# EAGLE design motion_sensor (EAGLE 7.7.0)

## Sheet 1 of 2
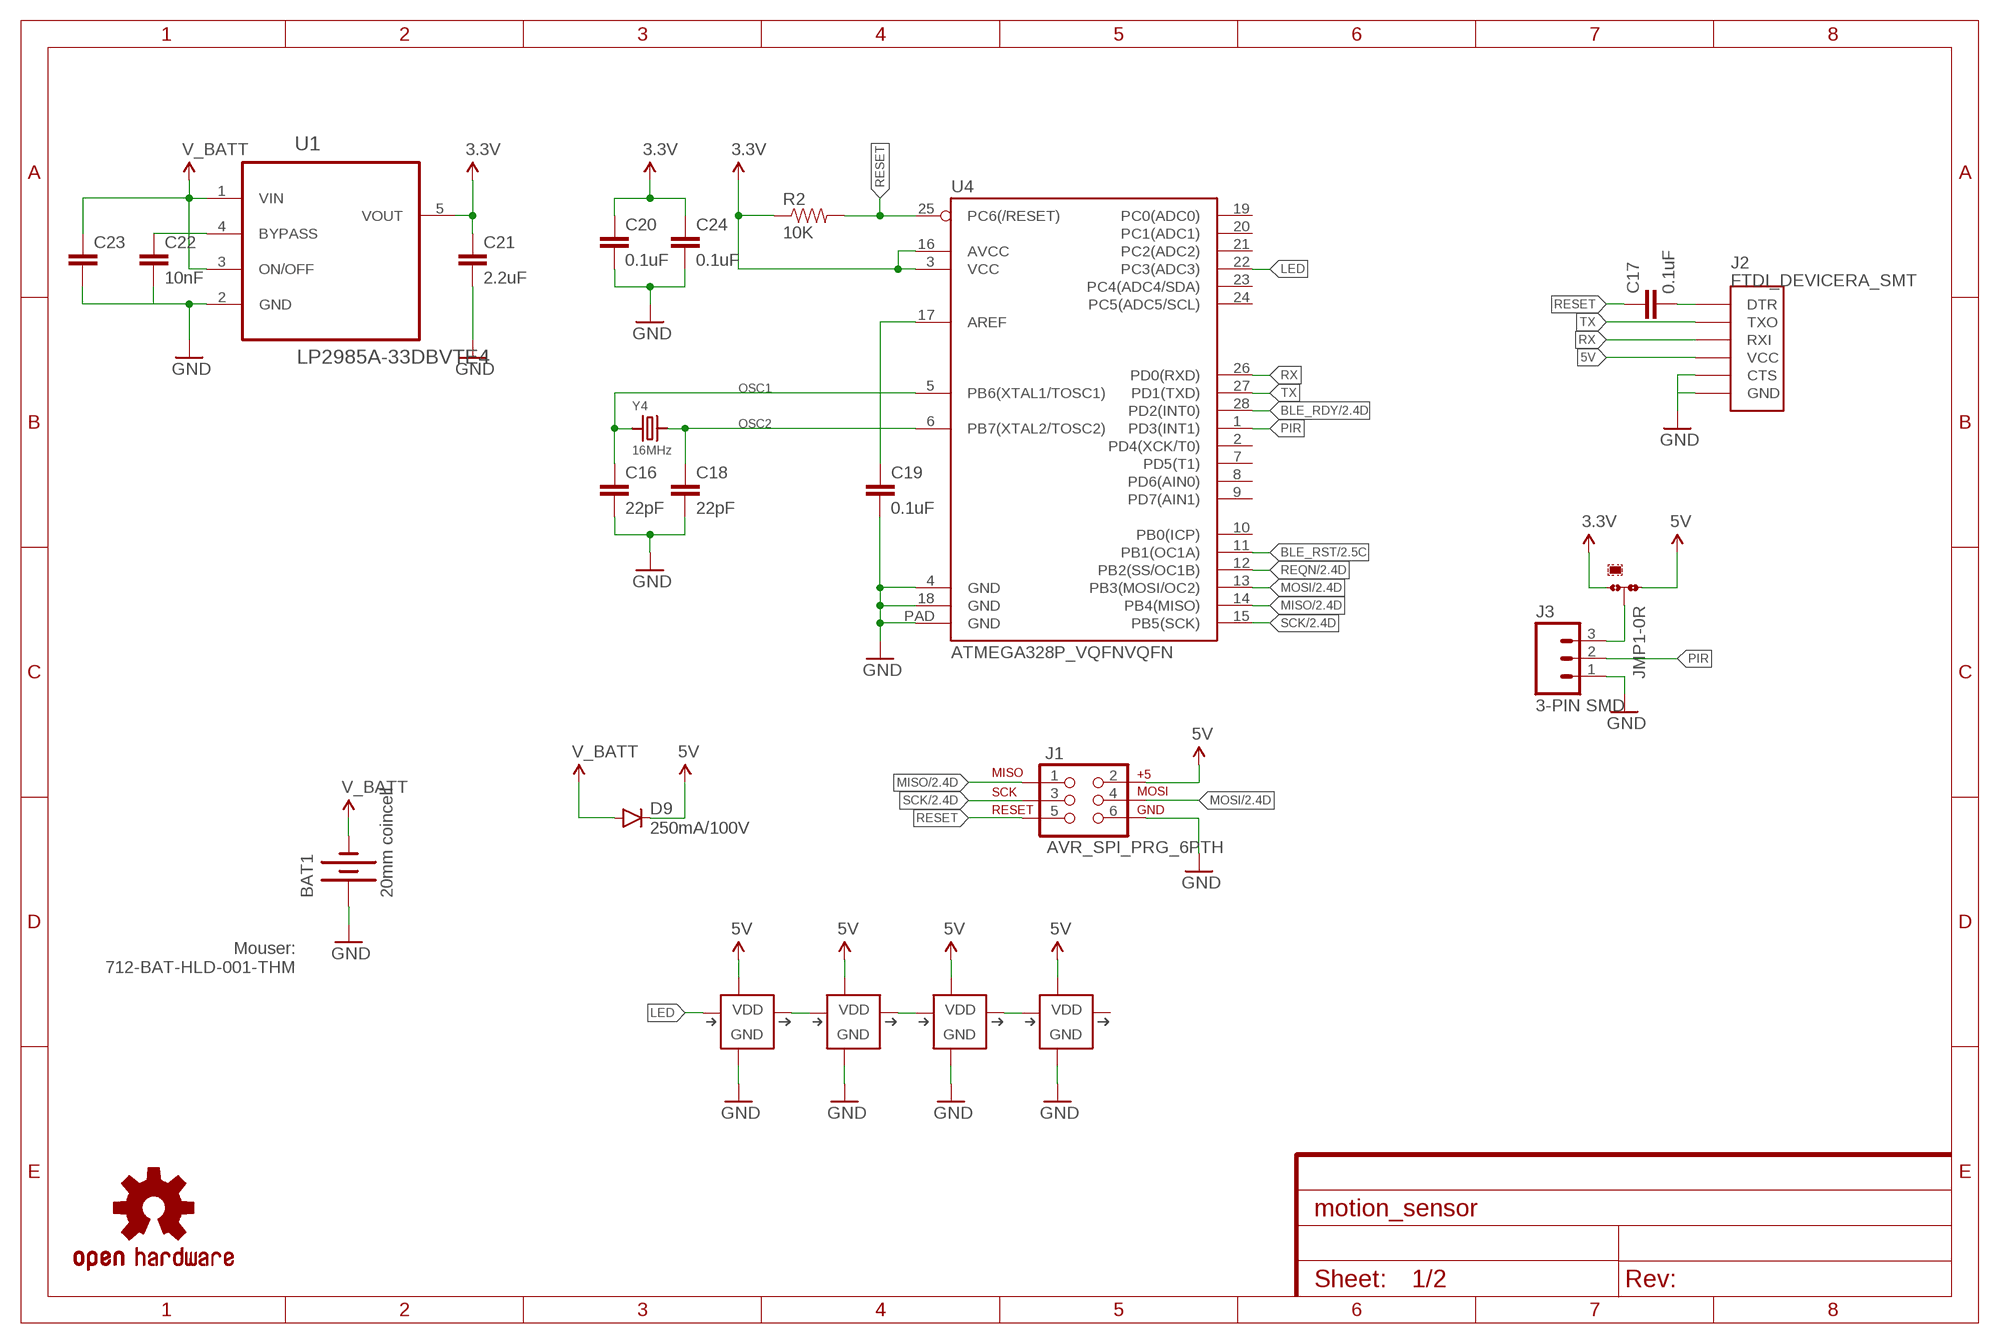
[diagram p0: schematic, sheet 1]

### Parts
BAT1  20mm coincell  BATTERY20MM_4LEGS  [BATTCON_20MM_4LEGS]
C16  22pF  22PF-50V-5%(0603)  [0603-CAP]
C17  0.1uF  0.1UF-25V(+80/-20%)(0603)  [0603-CAP]
C18  22pF  22PF-50V-5%(0603)  [0603-CAP]
C19  0.1uF  0.1UF-25V(+80/-20%)(0603)  [0603-CAP]
C20  0.1uF  0.1UF-25V(+80/-20%)(0603)  [0603-CAP]
C21  2.2uF  2.2UF-10V-20%(0603)  [0603-CAP]
C22  10nF  10NF/10000PF-50V-10%(0603)  [0603-CAP]
C23  1UF-25V-10%(0805)"  [0805-CAP]
C24  0.1uF  0.1UF-25V(+80/-20%)(0603)  [0603-CAP]
D9  250mA/100V  DIODEBAS16  [SOD-323]
J1  AVR_SPI_PRG_6PTH  [2X3]
J2  FTDI_DEVICERA_SMT  [FTDI_DEVICE_RA_SMT]
J3  3-PIN SMD  M03JST-SMD  [JST-3-SMD]
JMP1  0R-JUMPC  [C0R-JMP]
LOGO1  OSHW-LOGOS  [OSHW-LOGO-S]
R2  10K  RESISTOR0603-RES  [0603-RES]
U1  LP2985A-33DBVTE4  [SOT95P280X145-5N]
U4  ATMEGA328P_VQFNVQFN  [VQFN-28]
U$1  SK6812MINI  [LED-3535]
U$11  SK6812MINI  [LED-3535]
U$15  SK6812MINI  [LED-3535]
U$17  SK6812MINI  [LED-3535]
Y4  16MHz  CRYSTAL3.2X2.5  [CRYSTAL_3.2X2.5]

### Nets
3.3V: C20.1 C21.1 C24.1 JMP1.3 R2.1 U1.5(VOUT) U4.3(VCC) U4.16(AVCC) ; also sheet 2
5V: D9.C J1.2 J2.4(VCC) JMP1.1 U$1.3(VDD) U$11.3(VDD) U$15.3(VDD) U$17.3(VDD)
AREF: C19.1 U4.17(AREF)
BLE_RDY: U4.28(PD2(INT0)) ; also sheet 2
BLE_RST: U4.11(PB1(OC1A)) ; also sheet 2
BYPASS: C22.1 U1.4(BYPASS)
DTR: C17.2 J2.1(DTR)
GND: BAT1.POSITIVE@1(+) BAT1.POSITIVE@2(+) BAT1.POSITIVE@3(+) BAT1.POSITIVE@4(+) C16.2 C18.2 C19.2 C20.2 C21.2 C22.2 C23.2 C24.2 J1.6 J2.5(CTS) J2.6(GND) J3.1 U1.2(GND) U4.4(GND) U4.18(GND) U4.PAD(GND) U$1.1(GND) U$11.1(GND) U$15.1(GND) U$17.1(GND) ; also sheet 2
LED: U4.22(PC3(ADC3)) U$1.2(DI)
MISO: J1.1 U4.14(PB4(MISO)) ; also sheet 2
MOSI: J1.4 U4.13(PB3(MOSI/OC2)) ; also sheet 2
N$5: U$1.4(DO) U$11.2(DI)
N$6: U$11.4(DO) U$15.2(DI)
N$7: U$15.4(DO) U$17.2(DI)
OSC1: C16.1 U4.5(PB6(XTAL1/TOSC1)) Y4.1
OSC2: C18.1 U4.6(PB7(XTAL2/TOSC2)) Y4.2
PIR: J3.2 U4.1(PD3(INT1))
PIR_VDD: J3.3 JMP1.2
REQN: U4.12(PB2(SS/OC1B)) ; also sheet 2
RESET: C17.1 J1.5 R2.2 U4.25(PC6(/RESET))
RX: J2.3(RXI) U4.26(PD0(RXD))
SCK: J1.3 U4.15(PB5(SCK)) ; also sheet 2
TX: J2.2(TXO) U4.27(PD1(TXD))
V_BATT: BAT1.NEGATIVE(-) C23.1 D9.A U1.1(VIN) U1.3(ON/OFF)
Unconnected: U4.2(PD4(XCK/T0)) U4.7(PD5(T1)) U4.8(PD6(AIN0)) U4.9(PD7(AIN1)) U4.10(PB0(ICP)) U4.19(PC0(ADC0)) U4.20(PC1(ADC1)) U4.21(PC2(ADC2)) U4.23(PC4(ADC4/SDA)) U4.24(PC5(ADC5/SCL)) U$17.4(DO)

### Notes on the sheet
- Mouser:
  712-BAT-HLD-001-THM

## Sheet 2 of 2
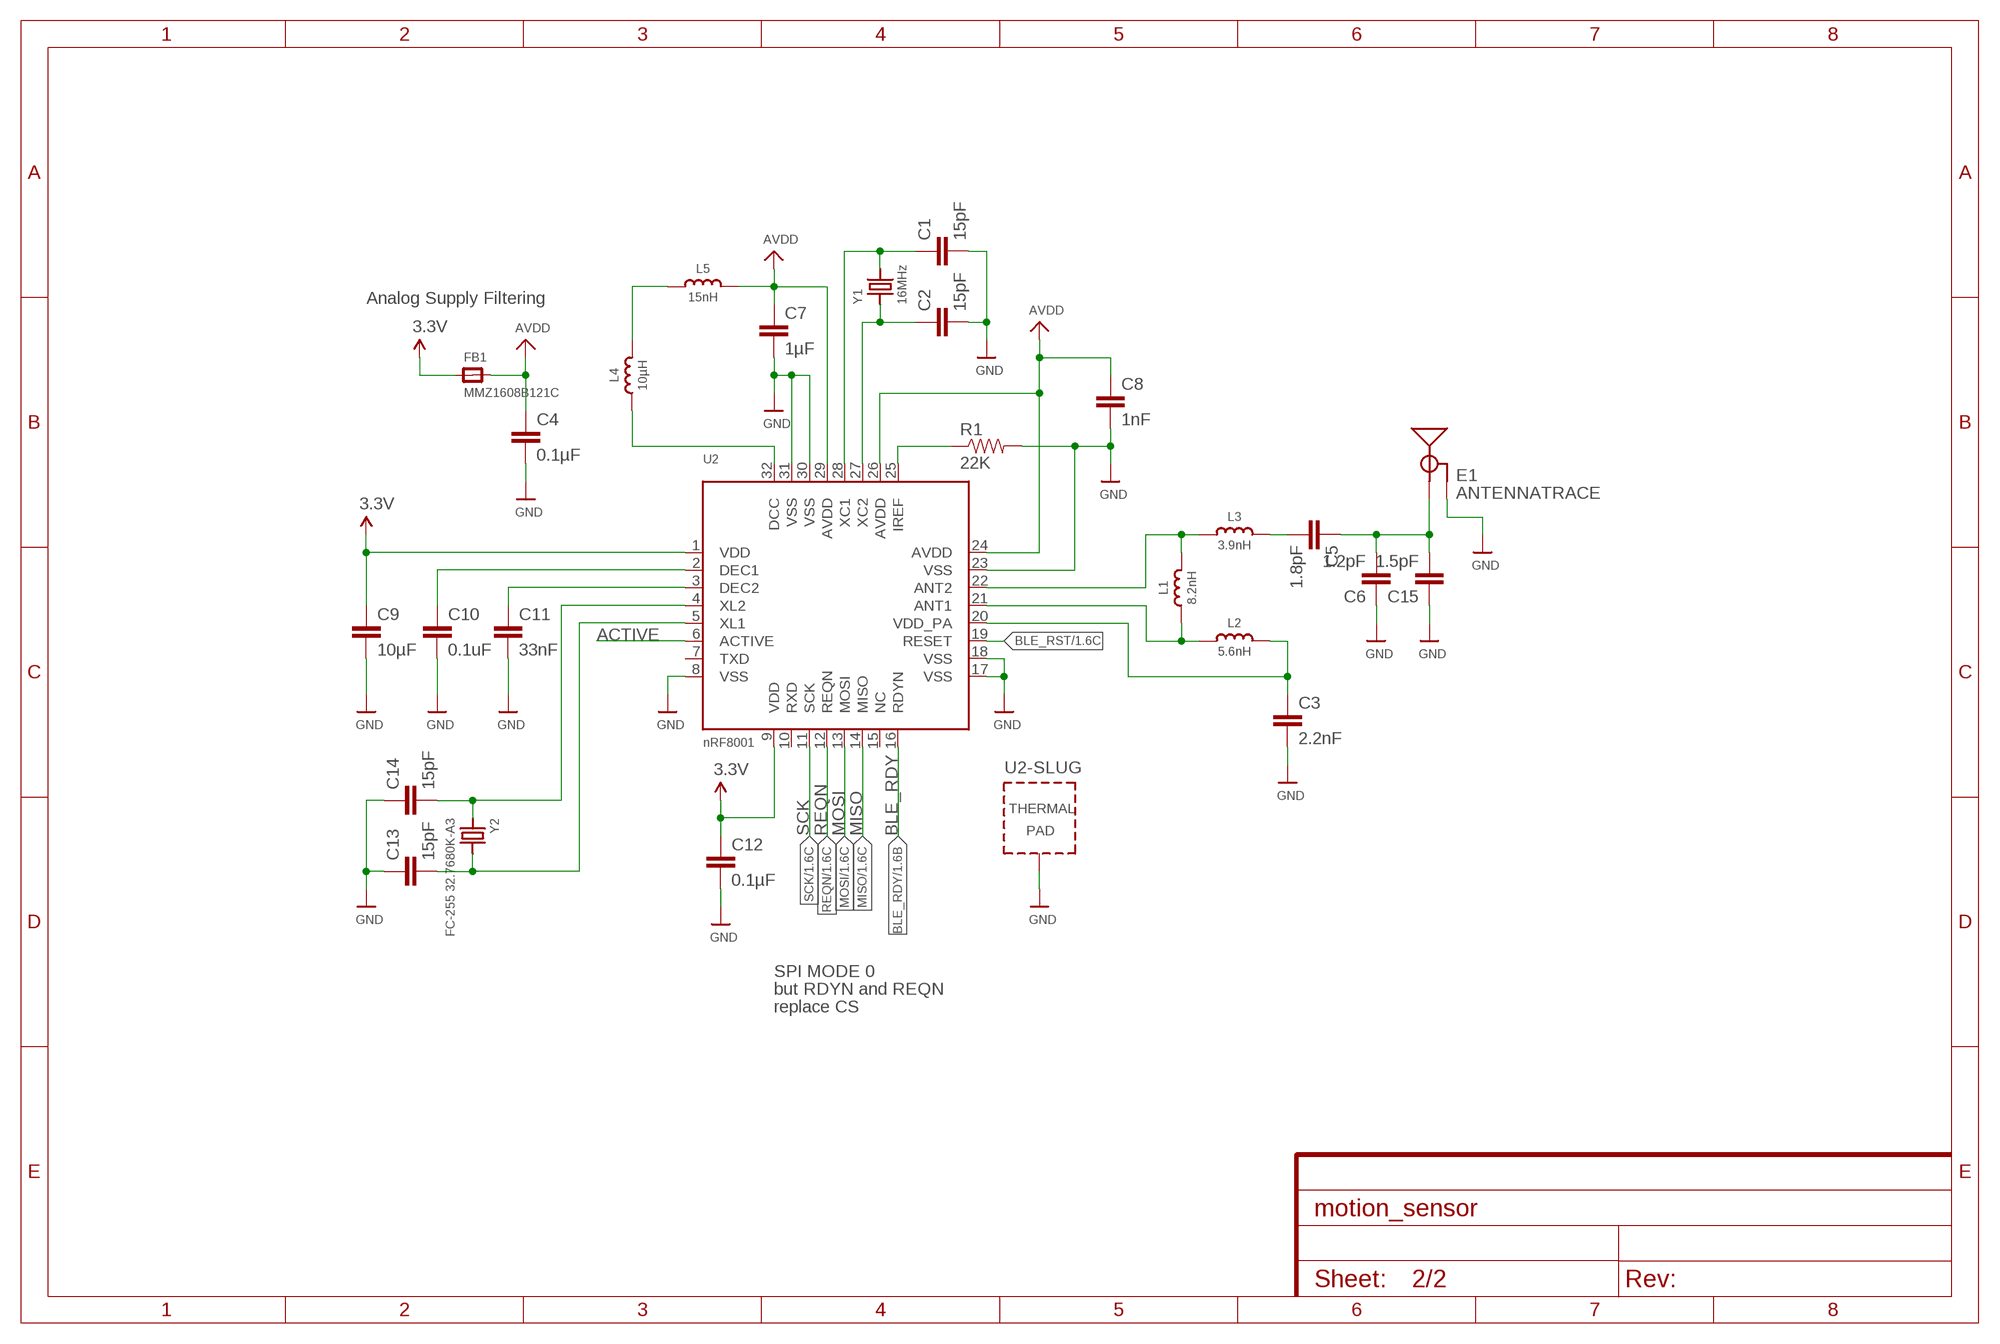
[diagram p1: schematic, sheet 2]

### Parts
C1  15pF  CAP0805  [0805]
C2  15pF  CAP0805  [0805]
C3  2.2nF  CAP0805  [0805]
C4  0.1µF  CAP0805  [0805]
C5  1.8pF  CAP0805  [0805]
C6  1.2pF  CAP0805  [0805]
C7  1µF  CAP0805  [0805]
C8  1nF  CAP0805  [0805]
C9  10µF  CAP0805  [0805]
C10  0.1uF  CAP0805  [0805]
C11  33nF  CAP0805  [0805]
C12  0.1µF  CAP0805  [0805]
C13  15pF  CAP0805  [0805]
C14  15pF  CAP0805  [0805]
C15  1.5pF  CAP0805  [0805]
E1  ANTENNATRACE  [TRACE_ANTENNA_2.4GHZ_25.7MM]
FB1  MMZ1608B121C  FERRITE0805  [0805]
L1  8.2nH  INDUCTOR_0402  [_0402]
L2  5.6nH  INDUCTOR_0402  [_0402]
L3  3.9nH  INDUCTOR_0402  [_0402]
L4  10µH  INDUCTOR_0603  [_0603]
L5  15nH  INDUCTOR_0603  [_0603]
R1  22K  RESISTOR0603-RES  [0603-RES]
U2  nRF8001  NRF8001  [QFN32_5MM]
Y1  16MHz  CRYSTAL3.2X2.5  [CRYSTAL_3.2X2.5]
Y2  FC-255 32.7680K-A3  CRYSTAL8.0X3.8  [CRYSTAL_8X3.8]

### Nets
3.3V: C9.1 C12.1 FB1.1 U2.1(VDD) U2.9(VDD) ; also sheet 1
???: L4.2 L5.1
ACTIVE: U2.6(ACTIVE)
AVDD: C4.1 C7.1 C8.1 FB1.2 L5.2 U2.24(AVDD) U2.26(AVDD) U2.29(AVDD)
BLE_RDY: U2.16(RDYN) ; also sheet 1
BLE_RST: U2.19(RESET) ; also sheet 1
DCC: L4.1 U2.32(DCC)
DEC1: C10.1 U2.2(DEC1)
DEC2: C11.1 U2.3(DEC2)
GND: C1.2 C2.2 C3.2 C4.2 C6.1 C7.2 C8.2 C9.2 C10.2 C11.2 C12.2 C13.1 C14.1 C15.1 E1.GND E1.GND2(GND) R1.2 U2.8(VSS) U2.17(VSS) U2.18(VSS) U2.23(VSS) U2.30(VSS) U2.31(VSS) U2.33(TP) ; also sheet 1
MISO: U2.14(MISO) ; also sheet 1
MOSI: U2.13(MOSI) ; also sheet 1
N$2: R1.1 U2.25(IREF)
N$4: C3.1 L2.2 U2.20(VDD_PA)
N$17: L1.2 L3.1 U2.22(ANT2)
N$18: L1.1 L2.1 U2.21(ANT1)
N$19: C5.2 L3.2
N$20: C5.1 C6.2 C15.2 E1.ANT(SIGNAL)
REQN: U2.12(REQN) ; also sheet 1
SCK: U2.11(SCK) ; also sheet 1
XC1: C1.1 U2.28(XC1) Y1.2
XC2: C2.1 U2.27(XC2) Y1.1
XL1: C13.2 U2.5(XL1) Y2.P$4
XL2: C14.2 U2.4(XL2) Y2.P$1
Unconnected: U2.7(TXD) U2.10(RXD) U2.15(NC)

### Notes on the sheet
- Analog Supply Filtering
- SPI MODE 0
- but RDYN and REQN
- replace CS

## Library data of the parts
BAT1 = SparkFun-Electromechanical:BATTERY: Battery Holders Various common sizes : AA, AAA, 18650 (PRT-12895), 20mm coin cell and 12mm coin cell. 20MM_4LEGS, BATT-10373; PROD_ID: BATT-10373
C1-C15 = SparkFun-Capacitors:CAP: Capacitor Standard 0603 ceramic capacitor, and 0.1" leaded capacitor.
C16 C18 = SparkFun-Capacitors:22PF-50V-5%(0603): CAP-07876; PROD_ID: CAP-07876
C17 C19 C20 C24 = SparkFun-Capacitors:0.1UF-25V(+80/-20%)(0603): CAP-00810 Ceramic Standard decoupling cap; PROD_ID: CAP-00810
C21 = SparkFun-Capacitors:2.2UF-10V-20%(0603): CAP-07888; PROD_ID: CAP-07888
C22 = SparkFun-Capacitors:10NF/10000PF-50V-10%(0603): CAP-00867; PROD_ID: CAP-00867
C23 = SparkFun-Capacitors:1UF-25V-10%(0805): CAP-08064
D9 = SparkFun-DiscreteSemi:DIODE: Diode These are standard reverse protection diodes and small signal diodes. SMA package can handle up to about 1A. SOD-323 can handle about 200mA. What the SOD-323 package when ordering, there are some mfgs out there that are 5-pin packages.; PROD_ID: DIO-09646
E1 = SparkFun-RF:ANTENNA: Chip antenna Chip antenna with ground or secondary connection. Common with larger metal RF connectors.
FB1 = microbuilder:FERRITE: Ferrite Bead 0603 MMZ1608B121C - 120 Ohm @ 100MHz, 600mA, 0.15 Ohm DC Resistance - Digikey: 445-2164-1-ND BK1608HW121-T - 120 Ohm, 600mA Ferrite Chip - Digikey: 587-1876-2-ND 0805 HZ0805B272R-10 - 2.7K Ohm @ 100MHz, 200mA, 0.8 Ohm DC Resistance - Digikey: 240-2504-1-ND (see also Murata BLM21BD272SN1L) MMZ2012Y152B - 1.5K Ohm @ 100MHz, 500mA, 0.4 Ohm DC Resistance - Digikey: 445-1560-1-ND - Mainly for high frequency (80-400MHz) MMZ2012R102A - 1K Ohm @ 100MHz, 500mA, 0.3 Ohm DC Resistance - Digikey: 445-1555-2-ND - More general purpose (10-200MHz)
J1 = SparkFun-Connectors:AVR_SPI_PRG_6: AVR ISP 6 Pin This is the reduced ISP connector for AVR programming. Common on Arduino. This footprint will take up less PCB space and can be used with a 10-pin to 6-pin adapter such as SKU: BOB-08508 **Special note about "TEST_POINT" package. The stop mask is on the top side, so if you want your programming test points to be on the bottom of your board, make sure to place this package on the bottom side of the board. This also ensure that the orientation to program from the bottom side will be correct.
J2 = SparkFun-Connectors:FTDI_DEVICE: Connector which mates to FTDI basic or FTDI cable.; PROD_ID: CONN-08971
J3 = SparkFun-Connectors:M03: Header 3 Standard 3-pin 0.1" header. Use with straight break away headers (SKU : PRT-00116), right angle break away headers (PRT-00553), swiss pins (PRT-00743), machine pins (PRT-00117), and female headers (PRT-00115). Molex polarized connector foot print use with SKU : PRT-08232 with associated crimp pins and housings.; PROD_ID: CONN-12591
JMP1 = jump-0r-smd:0R-JUMP: SMD 0R 0805 Jumper
L1-L5 = microbuilder:INDUCTOR: Inductors 0603: 10nH Ceramic Inductor - microwire antenna/RF (Digikey: 712-1434-2-ND) 0805: 560nH Ceramic Inductor - RF (Digikey: 553-1047-1-ND) 270nH Ceramic Inductor - Q = 40@250MHz, +-5%, 1 Ohm DC Resistance (Digikey: 535-10506-2-ND) 1007 (2518 Metric) SMT: 10µH 10% 250mOhm 820mA 1007 Inductor (Digikey: 587-2189-1-ND) 22µH 10% 500mOhm 580mA 1007 Inductor (Digikey: 587-2190-1-ND) 47µH 10% 950mOhm 420mA 1007 Inductor (Digikey: 587-2191-1-ND) 47µH 5% 100mOhm 1A 1008 Inductor (Digikey: 732-1816-1-ND) 5.0x5.0mm (Taiyo Yuden NR5040 Series) 6.8µH 20% 2.3A 64mOhm Inductor (Digikey: 587-2374-2-ND) 5.0x5.0mm (TDK VLC5045 Series) 4.7µH 20% 3.3A 34mOhm Inductor (Digikey: 445-6526-1-ND) 6.8µH 20% 2.7A 46mOhm Inductor (Digikey: 445-6527-1-ND) 6.0x6.0mm (TDK VLC6045 Series) 4.7µH 20% 3.8A 27mOhm Inductor (Digikey: 445-6538-2-ND) 6.8µH 20% 3A 41mOhm Inductor (Digikey: 445-6540-1-ND) 6.2µH 30% 2.2A 45mOhm Inductor (Digikey: SRR5028-6R2YCT-ND) - Not TDK VLC6045 but footprint should match 6.0x6.0mm (TDK SLF6045 Series) 6.8uH 30% 2A 33mOhm Inductor (Digikey: 445-4572-1-ND, Mouser: 810-SLF645T6R8N2R0PF) 6.0x6.0mm (Sumida CDRH5D28 Series) 6.2uH 30% 1.8A 45mOhm Inductor (Digikey: 308-1542-1-ND) Taiyo Yuden NR3015T2R2M - 2.2uH 20% 1.5A (Digikey: 587-1648-2-ND, Mouser: 963-NR3015T2R2M) - Used with TI TPS62172 CoilCraft RFID Transponder Coil - MA5532-AE (For use with AS3935 Lightning Sensor)
LOGO1 = SparkFun-Aesthetics:OSHW-LOGO: Open Source Hardware Logo This logo indicates the piece of hardware it is found on incorporates a OSHW license and/or adheres to the definition of open source hardware found here: http://freedomdefined.org/OSHW
R1 R2 = SparkFun-Resistors:RESISTOR: Resistor Basic schematic elements and footprints for 0603, 1206, and PTH resistors.
U1 = Texas Instruments_By_element14_Batch_1:LP2985A-33DBVTE4: 150-mA LOW-NOISE LOW-DROPOUT REGULATOR WITH SHUTDOWN; MPN: LP2985A-33DBVTE4; OC_FARNELL: 1053660; OC_NEWARK: 79K3928; PACKAGE: SOT-23-5; SUPPLIER: Texas Instruments
U2 = microbuilder:NRF8001: nRF8001 - Bluetooth Low-Energy Transceiver VDD: 1.9-3.6V Temp: -40°C - 85°C
U4 = SparkFun-DigitalIC:ATMEGA328P_VQFN
U$1 U$11 U$15 U$17 = pimoroni-optoelectronics:SK6812MINI
Y1 Y2 Y4 = microbuilder:CRYSTAL: Crystals HC49UP - Surface Mount Crystal 4.0MHz 18pF +/-30ppm Surface Mount Crystal [Digikey: 535-9857-1-ND] 12.0 MHz Surface Mount Crystal [Digikey: 535-9869-6-ND] 25.0 MHz Surface Mount Crystal [Digikey: 535-9078-1-ND] 2.5 x 2.0mm - MEMs SMT Crystal 16.0 MHz 10pF 20ppm 2.5 x 2.0mm Crystal [Digikey -40-85°C: 535-10923-1-ND] 3.2 x 2.5mm - MEMs SMT Crystal 12.0 MHz 8pF 15ppm 3.2 x 2.5mm Crystal [Digikey: -10-70°C: 644-1047-1-ND -40-125°C: 644-1128-1-ND] 40~85°C cheaper: 644-1173-6-ND 16.0 MHz 8pF 15ppm 3.2 x 2.5mm Crystal [Digikey: -10-70°C: 644-1049-1-ND -40-125°C: 644-1129-2-ND]-40~85°C cheaper: 644-1175-6-ND 16.0 MHz 10pF 10ppm 3.2 x 2.5mm Crystal [Digikey: 644-1100-1-ND] 27.12 MHz 18pF 30ppm 3.2 x 2.5mm Crystal [Digikey: 887-1424-1-ND] 27.12MHz 10pF 10ppm 3.2 x 2.5mm Crystal [Digikey: 887-1329-1-ND] 4.9 x 1.8mm - MEMs SMT Crystal 32.768 KHz 12.5pF 20ppm 4.9 x 1.8mm Crystal [Digikey: SE2415CT-ND] 8.0 x 3.8mm - Surface Mount Crystal 32.768kHz 12.5pF 20ppm -40°C-85°C [Digikey: 535-9166-2-ND] Cylinder 32.768KHz Cylinder Crystal (2x6mm body) [Ex. Digikey: 300-8341-2-ND]

## Board
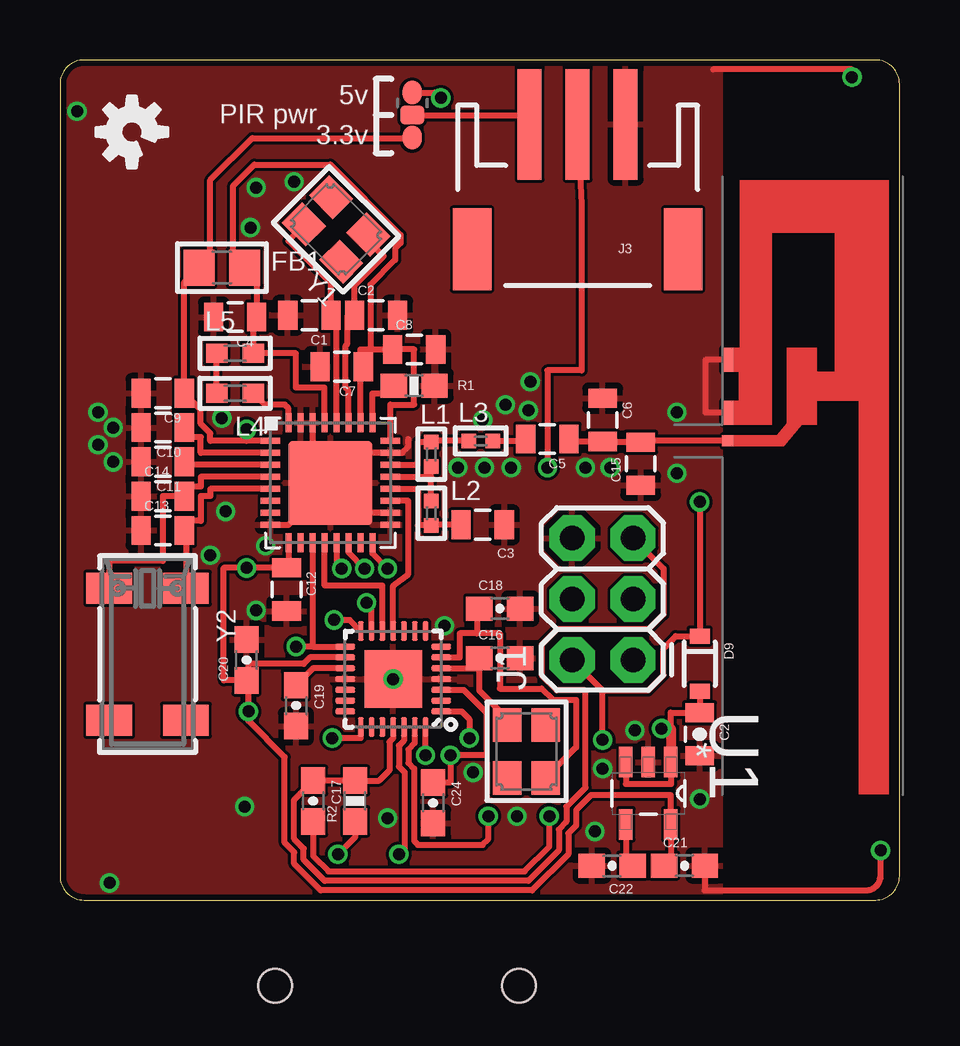
[diagram p2: board, top side]
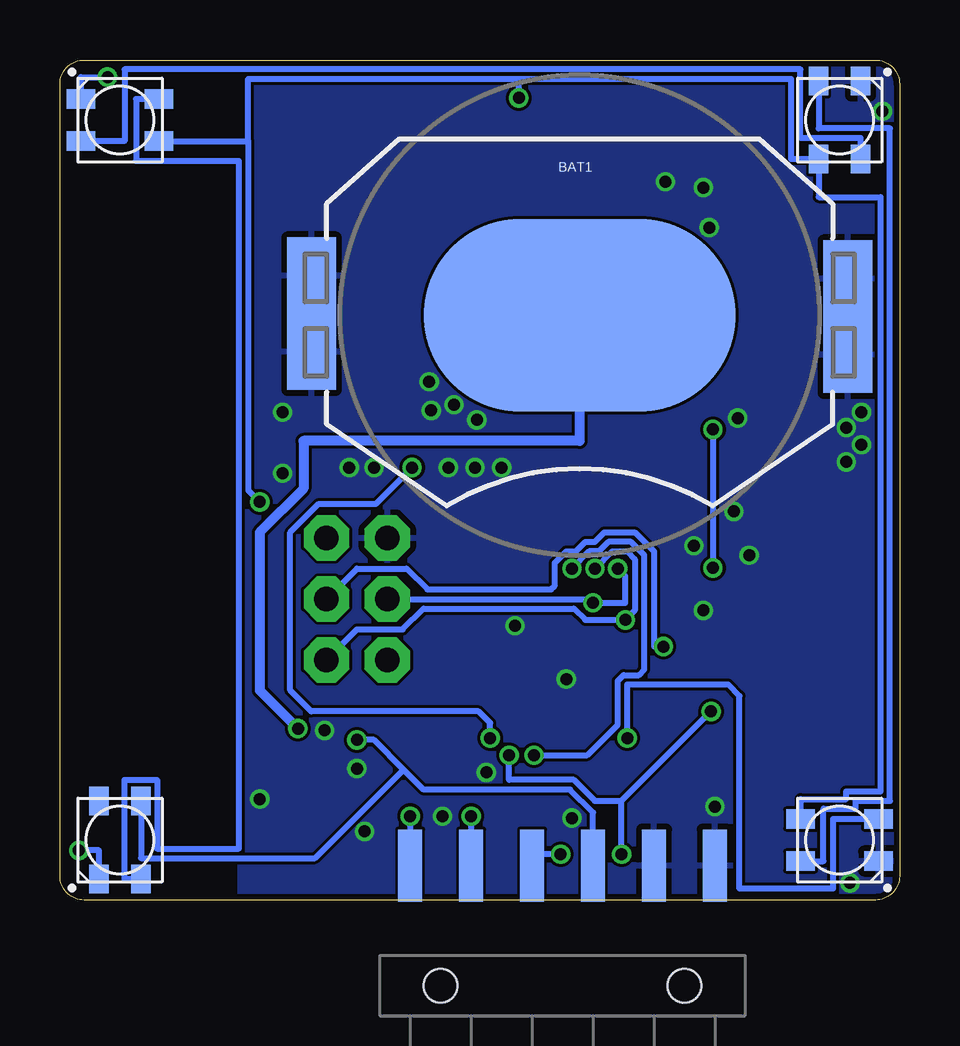
[diagram p3: board, bottom side, seen from below]

Size 35 x 35 mm. Coordinates in mm from the lower left corner, seen from the top.
Outline: 0,34 0,1 arc90 1,0 34,0 arc90 35,1 35,34 arc90 34,35 1,35 arc90 0,34
Copper layers (1*16): Top 0.035mm / dielectric 1.5mm / Bottom 0.035mm
Design rules "dirtypcbs": minimum track width 5mil, minimum drill 12mil, track to track 5mil, track to pad 5mil, pad to pad 5mil, via to via 5mil, smd to smd 0mil, copper to edge 10mil, drill to drill 10mil, minimum pad ring 10mil, minimum via ring 6mil, stop-mask expansion 2mil, vias tented up to drill 25mil, thermal gap 10mil

### Footprints (pad centres in the part's own frame; a part is rotated, then mirrored left to right if it is on the bottom)
BATTCON_20MM_4LEGS = smd 13 x 8: NEGATIVE 0,0 | smd 2.032 x 3.175: POSITIVE@1 -11.176,1.651; POSITIVE@2 -11.176,-1.524; POSITIVE@3 11.176,1.524; POSITIVE@4 11.176,-1.651
0805 = smd 0.8 x 1.2: 1 -0.9,0; 2 0.9,0
0603-CAP = smd 1.1 x 1: 1 -0.85,0; 2 0.85,0
0805-CAP = smd 0.8 x 1.2: 1 -0.9,0; 2 0.9,0
SOD-323 = smd 0.63 x 0.83: A 1.15,0; C -1.15,0
TRACE_ANTENNA_2.4GHZ_25.7MM = smd 0.46 x 0.46: ANT 0,0.23 | smd 1 x 0.46: GND -1.18,0.23; GND2 -3.38,0.23
0805' = smd 1.3 x 1.5: 1 -0.95,0; 2 0.95,0
2X3 = drill 1.016 pad 1.88 octagon: 1 0,0; 2 0,2.54; 3 2.54,0; 4 2.54,2.54; 5 5.08,0; 6 5.08,2.54
FTDI_DEVICE_RA_SMT = smd 1 x 3: 1 -6.35,5; 2 -3.81,5; 3 -1.27,5; 4 1.27,5; 5 3.81,5; 6 6.35,5 | hole 1.4: -5.08,0; 5.08,0
JST-3-SMD = smd 1 x 4.6: 1 -1.99,-4.77; 2 0.01,-4.77; 3 2.01,-4.77 | smd 1.6 x 3.4: NC1 -4.39,0.43; NC2 4.41,0.43
C0R-JMP = smd 0.8 x 1: 1 0,0.938; 3 0,-0.938 | smd 1 x 0.8: 2 0,0
_0402 = smd 0.6 x 0.6: 1 -0.508,0; 2 0.508,0
_0603 = smd 0.9 x 0.8: 1 -0.762,0; 2 0.762,0
0603-RES = smd 1.1 x 1: 1 -0.85,0; 2 0.85,0
SOT95P280X145-5N = smd 1.27 x 0.559: 1 -1.295,0.94; 2 -1.295,0; 3 -1.295,-0.94; 4 1.295,-0.94; 5 1.295,0.94
QFN32_5MM = smd 0.8 x 0.25: 1 -2.5,1.75; 2 -2.5,1.25; 3 -2.5,0.75; 4 -2.5,0.25; 5 -2.5,-0.25; 6 -2.5,-0.75; 7 -2.5,-1.25; 8 -2.5,-1.75; 17 2.5,-1.75; 18 2.5,-1.25; 19 2.5,-0.75; 20 2.5,-0.25; 21 2.5,0.25; 22 2.5,0.75; 23 2.5,1.25; 24 2.5,1.75 | smd 0.25 x 0.8: 9 -1.75,-2.5; 10 -1.25,-2.5; 11 -0.75,-2.5; 12 -0.25,-2.5; 13 0.25,-2.5; 14 0.75,-2.5; 15 1.25,-2.5; 16 1.75,-2.5; 25 1.75,2.5; 26 1.25,2.5; 27 0.75,2.5; 28 0.25,2.5; 29 -0.25,2.5; 30 -0.75,2.5; 31 -1.25,2.5; 32 -1.75,2.5 | smd 3.5 x 3.5: 33 0,0
VQFN-28 = smd 0.82 x 0.24: 1 -2,1.35; 2 -2,0.9; 3 -2,0.45; 4 -2,0; 5 -2,-0.45; 6 -2,-0.9; 7 -2,-1.35; 15 2,-1.35; 16 2,-0.9; 17 2,-0.45; 18 2,0; 19 2,0.45; 20 2,0.9; 21 2,1.35 | smd 0.24 x 0.82: 8 -1.35,-2; 9 -0.9,-2; 10 -0.45,-2; 11 0,-2; 12 0.45,-2; 13 0.9,-2; 14 1.35,-2; 22 1.35,2; 23 0.9,2; 24 0.45,2; 25 0,2; 26 -0.45,2; 27 -0.9,2; 28 -1.35,2 | smd 2.4 x 2.4: PAD 0,0
LED-3535 = smd 1.2 x 0.8: 1 -1.625,0.875; 2 -1.625,-0.875; 3 1.625,-0.875; 4 1.625,0.875
CRYSTAL_3.2X2.5 = smd 1.4 x 1.2: 1 -1.1,-0.8; 2 1.1,0.8; GND1 -1.1,0.8; GND2 1.1,-0.8
CRYSTAL_8X3.8 = smd 1.3 x 1.9: P$1 -2.75,-1.6; P$2 2.75,-1.6; P$3 2.75,1.6; P$4 -2.75,1.6

### Placement (x,y rotation side)
BAT1  13.34,24.37 0 bottom
C1  10.4,24.37 180 top
C2  13.18,24.37 0 top
C3  17.62,15.64 0 top
C4  7.3,24.29 180 top
C5  20.32,19.21 180 top
C6  22.62,20 270 top
C7  11.75,22.23 180 top
C8  14.76,22.94 0 top
C9  4.29,21.11 180 top
C10  4.29,19.68 180 top
C11  4.29,18.26 180 top
C12  9.45,12.94 270 top
C13  4.29,15.4 0 top
C14  4.29,16.83 0 top
C15  24.21,18.18 90 top
C16  18.34,10.08 0 top
C17  10.56,4.13 270 top
C18  18.34,12.14 0 top
C19  9.84,8.1 270 top
C20  7.78,10 90 top
C21  26.04,1.43 0 top
C22  23.02,1.43 180 top
C23  26.67,6.91 270 top
C24  15.56,4.05 270 top
D9  26.67,9.84 270 top
E1  27.62,19.13 270 top
FB1  MMZ1608B121C  [0805']  6.75,26.35 0 top
J1  23.89,10 90 top
J2  14.05,-3.57 0 bottom
J3  21.59,27.54 180 top
JMP1  14.68,32.7 0 top
L1  15.48,18.57 90 top
L2  15.48,16.11 270 top
L3  17.54,19.13 0 top
L4  7.3,21.11 180 top
L5  7.3,22.78 0 top
LOGO1  3,32 45 top
R1  14.76,21.43 0 top
R2  12.3,4.13 90 top
U1  24.53,4.45 270 top
U2  11.27,17.38 0 top
U4  13.89,9.21 180 top
U$1  2.5,2.5 180 bottom
U$11  2.5,32.5 270 bottom
U$15  32.5,32.5 0 bottom
U$17  32.5,2.5 90 bottom
Y1  11.51,27.94 135 top
Y2  3.65,10.24 270 top
Y4  19.45,6.19 270 top

### Tracks (layer width: path | path; a pad name or v marks a point on that pad's centre or on a via)
3.3V  (via drill 0.5)
  Top 0.254: U4.16 10.43,10.11 10.16,9.84 7.86,9.84 C20.1 | C20.1 6.83,9.15 6.83,13.84 v7.78,13.84 C12.1 9.52,13.91 U2.9 | U4.3 16.83,8.76 17.78,7.8 17.78,6.03 v16.27,6.03 16.27,4.9 C24.1 | U2.1 7.78,19.13 | v7.78,19.61 7.78,19.13 | 7.78,19.13 6.27,19.13 6.27,19.45 5.87,19.84 5.87,20.43 C9.1 5.19,25.72 | R2.1 12.3,2.62 v11.59,1.91 | C20.1 7.83,9.15 7.86,9.13 v7.86,7.86 7.86,7.46 9.37,5.95 9.37,2.38 9.76,1.98 9.76,1.51 10.87,0.4 19.68,0.4 21.19,1.91 21.19,2.78 21.51,3.1 21.51,3.73 22.15,4.37 25.47,4.37 U1.5 25.47,1.43 C21.1 | 6.03,26.35 FB1.1 5.19,25.74 5.19,25.72 | 5.19,25.72 6.27,25.72 6.27,30 8.02,31.75 JMP1.3
  Bottom 0.254: v7.78,19.61 v7.78,13.84 | v16.27,6.03 16.27,5 13.57,5 12.7,4.13 11.59,4.13 | v11.59,1.91 11.59,4.13 | 11.59,4.13 v7.86,7.86
5V  (via drill 0.5)
  Top 0.254: J1.2 22.62,8.73 | 22.62,8.73 24.53,8.73 25.16,9.37 25.16,10.48 25.68,10.99 D9.C v26.67,16.59 | v22.62,6.67 22.62,8.73 | JMP1.1 15.62,33.64 v15.88,33.42
  Bottom 0.254: J2.4 12.78,3.65 13.73,4.6 19.84,4.6 20.68,5.44 | 20.68,5.44 21.91,6.67 v22.62,6.67 | U$1.3 4.12,4.21 2.22,4.21 2.22,4.52 0.79,4.52 0.79,29.29 3.38,29.29 U$11.3 4.52,30.88 4.52,34.21 15.88,34.21 | U$15.3 27.15,31.62 | 27.15,31.62 27.15,17.07 v26.67,16.59 | U$17.3 31.62,1.75 24.37,1.75 20.68,5.44 | 27.15,31.62 27.15,34.21 15.88,34.21 | v15.88,33.42 15.88,34.21
???
  Top 0.254: L4.2 L5.1
AREF
  Top 0.254: U4.17 10.55,9.66 C19.1
AVDD
  Top 0.254: U2.26 12.52,22.54 | 12.52,22.54 12.52,22.94 12.94,22.94 | 12.94,22.94 C8.1 14.76,22.94 14.76,20.64 13.77,20.64 U2.24 | U2.29 11.02,21.35 9.84,21.35 9.84,22.78 L5.2 8.06,24.15 C4.1 8.2,25.85 FB1.2 7.22,26.83 7.22,29.77 8.1,30.64 11.27,30.64 14.21,27.7 14.21,27.38 13.97,27.15 13.97,26.67 12.94,25.64 12.94,22.94 | C7.1 12.52,22.54
BLE_RDY  (via drill 0.5)
  Top 0.254: U2.16 13.02,14.44 v13.65,13.81 | v15.24,6.03 U4.28
  Bottom 0.254: v13.65,13.81 12.94,14.53 12.54,14.53 12.14,14.92 11.19,14.92 10.64,14.37 10.64,9.6 10.87,9.37 11.51,9.37 11.75,9.13 11.75,7.3 13.02,6.03 v15.24,6.03
BLE_RST
  Top 0.254: U4.11 13.89,13.1 14.53,13.57 14.53,16.63 U2.19
BYPASS
  Top 0.254: U1.4 23.59,1.43 C22.1
DCC
  Top 0.254: U2.32 9.52,20.48 9.37,20.64 8.54,20.64 L4.1
DEC1
  Top 0.254: U2.2 5.87,18.63 5.87,19.29 5.19,19.29 C10.1
DEC2
  Top 0.254: U2.3 5.31,18.13 C11.1
DTR  (via drill 0.5)
  Top 0.254: C17.2 10.56,1.83 11.19,1.19 19.37,1.19 20.4,2.22 v20.4,3.49
  Bottom 0.254: v20.4,3.49 J2.1
GND  (via drill 0.5)
  Top 0.254: E1.GND2 26.91,22.51 26.91,20.31 E1.GND | U2.8 9.52,15.63 U2.33 | 11.63,17.74 12.52,18.63 U2.23 14.27,18.63 14.53,18.89 14.53,19.21 | 11.63,17.74 U2.33 | U2.30 10.52,18.85 11.63,17.74 | v33.02,34.29 33.02,34.61 27.23,34.61 | C21.2 26.89,0.4 33.59,0.4 arc90 34.21,1.02 v34.21,2.06 | U2.18 11.27,16.13 U2.33
  Bottom 0.254: U$15.1 34.12,34.29 v33.02,34.29 | U$17.1 33.38,2.06 v34.21,2.06
  other vias: 16.59,18.02 17.7,18.02 22.94,18.02 21.91,18.02 18.81,18.02 25.72,17.78 25.72,20.32 8.18,12.06 13.65,3.41 26.67,4.21 16.03,11.43 13.89,9.21 2.06,0.71 0.71,32.86 22.3,2.86 19.05,3.49 7.7,3.89 17.22,5.32 17.62,20 18.57,20.64 19.53,20.4 19.61,21.59 6.75,20.08 2.22,19.68 1.59,20.32 1.59,18.97 2.22,18.26 23.97,7.06 22.62,5.48 8.57,14.76 6.91,16.19 6.27,14.37 8.18,29.69 9.76,29.92 7.94,28.02
  pour Bottom: 0,35 27.5,35 27.5,0 0,0
  pour Top: 0,35 27.5,35 27.5,0 0,0
LED  (via drill 0.5)
  Top 0.254: U4.22 12.54,6.75 v11.35,6.75
  Bottom 0.254: U$1.2 2.78,3.38 2.78,0.48 6.67,0.48 6.67,8.49 7.14,8.97 11.35,8.97 v11.35,6.75
MISO  (via drill 0.5)
  Top 0.254: U2.14 12.02,14.49 v12.7,13.81 | v11.43,11.67 12.08,11.67 U4.14
  Bottom 0.254: v12.7,13.81 11.99,14.53 11.35,14.53 11.03,14.21 11.03,12.06 v11.43,11.67 13.1,11.67 13.57,12.14 19.84,12.14 20.72,11.27 22.62,11.27 J1.1
MOSI  (via drill 0.5)
  Top 0.254: U4.13 12.99,12.22 v12.78,12.38 | U2.13 11.52,13.81 v11.75,13.81
  Bottom 0.254: J1.4 12.94,12.54 v12.78,12.38 11.43,12.38 11.43,13.49 v11.75,13.81
N$2
  Top 0.254: U2.25 13.02,21.11 13.89,21.11 13.91,21.14 R1.1
N$4
  Top 0.254: U2.20 14.92,17.13 14.92,15.61 L2.2 15.48,15.64 C3.1
N$5
  Bottom 0.254: U$1.4 3.17,1.62 3.17,3.81 1.83,3.81 1.83,4.13 0.4,4.13 0.4,32.15 3.38,32.15 U$11.2
N$6
  Bottom 0.254: U$11.4 1.62,31.75 4.13,31.75 4.13,34.61 32.31,34.61 32.31,31.62 U$15.2
N$7
  Bottom 0.254: U$15.4 31.83,33.38 31.83,30.8 27.54,30.8 27.54,2.14 30.96,2.14 30.96,5 32.31,5 32.31,0.88 U$17.2
N$17
  Top 0.254: U2.22 14.92,18.13 14.92,19.08 L1.2 15.48,19.13 L3.1
N$18
  Top 0.254: U2.21 15.48,17.63 L1.1 L2.1
N$19
  Top 0.254: L3.2 19.37,19.13 C5.2
N$20
  Top 0.254: E1.ANT 24.21,19.13 C15.2 22.62,19.08 C6.2 21.22,19.1 C5.1
OSC1
  Top 0.254: U4.5 17.49,9.66 C16.1 17.49,8.72 18.65,7.55 18.65,7.3 Y4.1
OSC2
  Top 0.254: U4.6 16.67,10.11 16.67,11.11 17.38,11.11 | C18.1 17.49,11.85 17.38,11.85 17.38,11.11 | 17.38,11.11 18.34,11.11 18.34,8.81 20.08,8.81 20.56,8.33 21.51,8.33 21.51,6.36 Y4.2
PIR  (via drill 0.5)
  Top 0.254: J3.2 21.75,28.98 21.75,22.07 20.32,22.07 v20.32,18.02 | U4.1 16.75,7.86 17.07,7.54 v17.07,6.75
  Bottom 0.254: v17.07,6.75 17.07,7.38 17.54,7.86 24.53,7.86 25.4,8.73 25.4,15.32 24.21,16.51 21.83,16.51 v20.32,18.02
PIR_VDD
  Top 0.254: JMP1.2 19.58,32.7 J3.3
REQN
  Top 0.254: U4.12 13.44,13.1 11.03,13.1 11.03,14.88 U2.12
RESET
  Top 0.254: U4.25 13.89,6.75 13.73,6.59 13.73,5.4 13.31,4.98 R2.2 C17.1 9.76,4.18 9.76,2.54 10.16,2.14 10.16,1.67 11.03,0.79 19.53,0.79 20.8,2.06 20.8,2.94 21.11,3.25 21.11,3.89 21.91,4.68 21.91,8.73 20.72,8.73 20.08,9.37 20.08,10.64 20.72,11.27 24.53,11.27 25.16,11.91 25.16,13.81 J1.5
RX  (via drill 0.5)
  Top 0.254: U4.26 14.34,6.64 14.13,6.43 14.13,5.56 14.37,5.32 14.37,2.14 v14.13,1.91
  Bottom 0.254: v14.13,1.91 15,1.91 J2.3
SCK  (via drill 0.5)
  Top 0.254: U2.11 10.52,10.56 | 10.52,10.56 U4.15 | 10.52,10.56 | 10.52,10.56 v9.84,10.56
  Bottom 0.254: J1.3 22.62,13.81 20.56,13.81 19.68,12.94 14.53,12.94 14.37,13.1 14.37,14.05 13.89,14.53 13.49,14.53 13.1,14.92 12.7,14.92 12.3,15.32 11.03,15.32 10.24,14.53 10.24,10.56 v9.84,10.56
TX  (via drill 0.5)
  Top 0.254: U4.27 14.79,6.54 14.53,6.27 14.53,5.71 14.76,5.48 14.76,2.46 14.92,2.3 17.62,2.3 17.86,2.54 v17.86,3.49
  Bottom 0.254: v17.86,3.49 J2.2
V_BATT  (via drill 0.5)
  Top 0.254: 25.47,7.14 25.47,7.81 C23.1 D9.A | U1.3 23.59,4.84 25.48,4.84 U1.1
  Top 0.406: v25.08,7.14 25.47,7.14 U1.1
  Bottom 0.406: BAT1.NEGATIVE 13.34,19.13 24.84,19.13 24.84,17.14 26.67,15.32 26.67,8.73 v25.08,7.14
XC1
  Top 0.254: U2.28 11.52,24.37 C1.1 11.3,25.69 9.53,27.46 10.17,28.11 Y1.2
XC2
  Top 0.254: U2.27 12.02,21.24 11.91,21.35 11.91,23.1 11.99,23.18 11.99,24.33 12.02,24.37 C2.1 12.28,25.61 13.49,26.83 12.85,27.47 Y1.1
XL1
  Top 0.254: U2.5 6.27,17.13 6.27,16.83 5.87,16.83 5.87,15.8 5.19,15.8 C13.2 5.25,15.4 Y2.P$4
XL2
  Top 0.254: U2.4 5.87,17.63 5.87,17.22 5.19,17.22 C14.2 4.29,16.83 4.29,14.13 2.05,14.13 Y2.P$1

### Text on the board
tNames: 5v | PIR pwr | 3.3v